# Altium schematic sheet Auto_old.SchDoc
size A
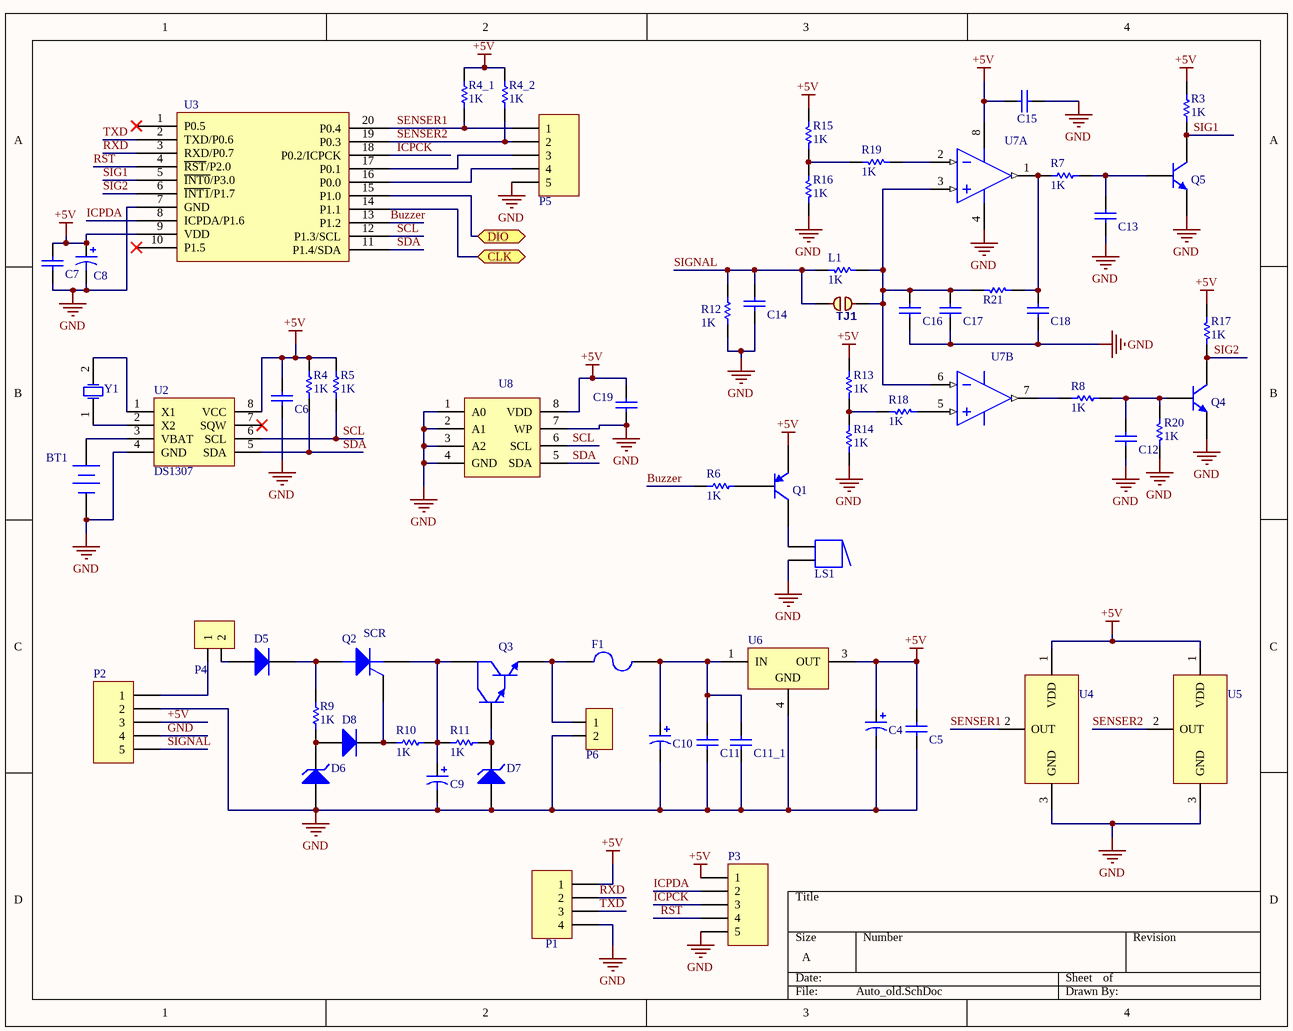
[diagram p0: Auto_old.SchDoc]

## Parts
BT1  Battery  [Battery Holder(CR2032)]  (value not drawn)
C4  Capacitor_Electrolytic  [C1000uF25V]  (value not drawn)
C5  Capacitor_Ceramic  [C0603]  (value not drawn)
C6  Capacitor_Ceramic  [C0603]  (value not drawn)
C7  Capacitor_Ceramic  [C0603]  (value not drawn)
C8  Capacitor_Electrolytic  [C10uF25V]  (value not drawn)
C9  Capacitor_Electrolytic  [C1000uF50V]  (value not drawn)
C10  Capacitor_Electrolytic  [C1000uF50V]  (value not drawn)
C11  Capacitor_Ceramic  [C0805]  (value not drawn)
C11_1  Capacitor_Ceramic  [Capacitor_Ceramic]  (value not drawn)
C12  Capacitor_Ceramic  [C0603]  (value not drawn)
C13  Capacitor_Ceramic  [C0603]  (value not drawn)
C14  Capacitor_Ceramic  [C0603]  (value not drawn)
C15  Capacitor_Ceramic  [C0603]  (value not drawn)
C16  Capacitor_Ceramic  [C0603]  (value not drawn)
C17  Capacitor_Ceramic  [C0603]  (value not drawn)
C18  Capacitor_Ceramic  [C0603]  (value not drawn)
C19  Capacitor_Ceramic  [C0603]  (value not drawn)
D5  Diode  [DO-241]  (value not drawn)
D6  D Zener  [LL-41]  (value not drawn)
D7  D Zener  [LL-41]  (value not drawn)
D8  Diode  [DO-241]  (value not drawn)
F1  Fuse  [1812(PTC Fuse)]  (value not drawn)
L1  value 1K  [Axial 1/4W]  (hidden comment: Res1)
LS1  Buzzer  [Buzzer]  (value not drawn)
P1  Header 4  [HDR1X4]  (value not drawn)
P2  Header 5  [Connector_508_5pin]  (value not drawn)
P3  Header 5  [HDR1X5]  (value not drawn)
P4  Header 2X1  [HDR1X2_2515]  (value not drawn)
P5  Header 5  [HDR1X5_2515]  (value not drawn)
P6  Header 2X1  [HDR1X2_2515]  (value not drawn)
Q1  PNP  [SOT-23]  (value not drawn)
Q2  SCR  [DPAK_SOT423_252]
Q3  NPN1  [DPAK_SOT423_252]  (value not drawn)
Q4  NPN  [SOT-23]  (value not drawn)
Q5  NPN  [SOT-23]  (value not drawn)
R3  value 1K  [R0603]  (hidden comment: Res1)
R4  value 1K  [R0603]  (hidden comment: Res1)
R4_1  value 1K  [R0603]  (hidden comment: Res1)
R4_2  value 1K  [R0603]  (hidden comment: Res1)
R5  value 1K  [R0603]  (hidden comment: Res1)
R6  value 1K  [R0603]  (hidden comment: Res1)
R7  value 1K  [R0603]  (hidden comment: Res1)
R8  value 1K  [R0603]  (hidden comment: Res1)
R9  value 1K  [R1206]  (hidden comment: Res1)
R10  value 1K  [R1206]  (hidden comment: Res1)
R11  value 1K  [R1206]  (hidden comment: Res1)
R12  value 1K  [R0603]  (hidden comment: Res1)
R13  value 1K  [R0603]  (hidden comment: Res1)
R14  value 1K  [R0603]  (hidden comment: Res1)
R15  value 1K  [R0603]  (hidden comment: Res1)
R16  value 1K  [R0603]  (hidden comment: Res1)
R17  value 1K  [R0603]  (hidden comment: Res1)
R18  value 1K  [R0603]  (hidden comment: Res1)
R19  value 1K  [R0603]  (hidden comment: Res1)
R20  value 1K  [R0603]  (hidden comment: Res1)
R21  Res1  [R0603]  (value not drawn)
TJ1  JUMPER-PAD-2-NO_BY_TRACE  [PAD_JUMPER_2_NO]  (value not drawn)
U2  DS1307  [SOIC-8N]
U3  8051  [TSSOP-20]  (value not drawn)
U4  Hall effect Switch  [SOT-23]  (value not drawn)
U5  Hall effect Switch  [SOT-23]  (value not drawn)
U6  LM7805_DPAK  [DPAK_SOT423_252]  (value not drawn)
U7  OP-AMP  [SOIC-8N]  (value not drawn)  (parts A,B of 2)
U8  EEPROM  [SOIC-8N]  (value not drawn)
Y1  XTAL  [Craystal]  (value not drawn)

## Ports
CLK, DIO

## Nets
+5V: C4.1 C5.2 C6.2 C7.2 C8.1 C15.2 C19.1 P1.1 P2.3 P3.1 Q1.2(E) R3.1 R4.2 R4_1.2 R4_2.2 R5.2 R13.1 R15.2 R17.2 U2.8(VCC) U3.9(VDD) U4.1(VDD) U5.1(VDD) U6.3(OUT) U7.8(VCC) U8.8(VDD)
GND: BT1.2(-) C4.2 C5.1 C6.1 C7.1 C8.2 C9.2 C10.2 C11.1 C11_1.1 C12.1 C13.1 C14.1 C15.1 C16.2 C17.2 C18.2 C19.2 D6.1(A) D7.1(A) LS1.2 P1.4 P2.2 P2.4 P3.5 P5.5 P6.2 Q4.2(E) Q5.2(E) R12.2 R14.1 R16.1 R20.2 U2.4(GND) U3.7(GND) U4.3(GND) U5.3(GND) U6.4(GND) U7.4(GND) U8.1(A0) U8.2(A1) U8.3(A2) U8.4(GND) U8.7(WP)
Buzzer: R6.2 U3.13(P1.2)
CLK: U3.14(P1.1) ; port CLK
DIO: U3.15(P1.0) ; port DIO
ICPCK: P3.3 U3.18(P0.2/ICPCK)
ICPDA: P3.2 U3.8(ICPDA/P1.6)
RST: P3.4 U3.4(~{RST}/P2.0)
RXD: P1.2 U3.3(RXD/P0.7)
SCL: R5.1 U2.6(SCL) U3.12(P1.3/SCL) U8.6(SCL)
SDA: R4.1 U2.5(SDA) U3.11(P1.4/SDA) U8.5(SDA)
SENSER1: P5.1 R4_1.1 U3.20(P0.4) U4.2(OUT)
SENSER2: P5.2 R4_2.1 U3.19(P0.3) U5.2(OUT)
SIG1: Q5.3(C) R3.2 U3.5(~{INT0}/P3.0)
SIG2: Q4.3(C) R17.1 U3.6(~{INT1}/P1.7)
SIGNAL: C14.2 L1.1 P2.5 R12.1 TJ1.1
TXD: P1.3 U3.2(TXD/P0.6)
NetBT1_1: BT1.1(+) U2.3(VBAT)
NetC9_1: C9.1 Q2.1(K) Q3.4(C) R10.1 R11.2
NetC10_1: C10.1 C11.2 C11_1.2 F1.2 U6.1(IN)
NetC12_2: C12.2 Q4.1(B) R8.2 R20.1
NetC13_2: C13.2 Q5.1(B) R7.2
NetC16_1: C16.1 C17.1 L1.2 R21.1 TJ1.2 U7.3(IN+) U7.6(IN-)
NetC18_1: C18.1 R7.1 R21.2 U7.1(OUT)
NetD5_1: D5.1(A) P4.2
NetD5_2: D5.2(K) Q2.4(A) R9.2
NetD6_2: D6.2(K) D8.1(A) R9.1
NetD7_2: D7.2(K) Q3.1(B) R11.1
NetD8_2: D8.2(K) Q2.3(G) R10.2
NetF1_1: F1.1 P6.1 Q3.3(E)
NetLS1_1: LS1.1 Q1.3(C)
NetP2_1: P2.1 P4.1
NetP5_3: P5.3 U3.17(P0.1)
NetP5_4: P5.4 U3.16(P0.0)
NetQ1_1: Q1.1(B) R6.1
NetR8_1: R8.1 U7.7(OUT)
NetR13_2: R13.2 R14.2 R18.2
NetR15_1: R15.1 R16.2 R19.2
NetR18_1: R18.1 U7.5(IN+)
NetR19_1: R19.1 U7.2(IN-)
NetU2_1: U2.1(X1) Y1.2(OSC2)
NetU2_2: U2.2(X2) Y1.1(OSC1)

Not connected (* = marked no-connect by the designer): U2 7(SQW)*; U3 1(P0.5)* 10(P1.5)*

## Library data of the parts
BT1 = Battery: Cell Battery; Published: 24-Mar-1999; LatestRevisionDate: 17-Jul-2002; LatestRevisionNote: Re-released for DXP Platform.; PackageReference: BAT-2; Publisher: Altium Limited; PackageDescription: Battery; 2 Leads
D6 D7 = D Zener: Zener Diode; Published: 8-Jun-2000; LatestRevisionDate: 17-Jul-2002; LatestRevisionNote: Re-released for DXP Platform.; PackageReference: DIODE-0.7; Publisher: Altium Limited; PackageDescription: Diode, Thru-Hole; 2 Leads; 0.7 in Pin Spacing
L1 R3 R4 R4_1 R4_2 R5-R20 = Res1: Resistor; Published: 8-Jun-2000; LatestRevisionDate: 17-Jul-2002; LatestRevisionNote: Re-released for DXP Platform.; PackageReference: AXIAL-0.3; Publisher: Altium Limited; PackageDescription: Axial Device, Thru-Hole; 2 Leads; 0.3 in Pin Spacing
LS1 = Buzzer: Magnetic Transducer Buzzer; Published: 24-Mar-1999; LatestRevisionDate: 17-Dec-2003; LatestRevisionNote: Schematic revised, PCB Footprint replaced.; DatasheetVersion: 17-Dec-2003; PackageReference: ABSM-1574; Publisher: Altium Limited; PackageDescription: Magnetic Transducer Buzzer; ComponentLink1Description: Manufacturer Link; ComponentLink1URL: http://www.megastar.com/linecard/buzzmode/index.php
P1 = Header 4: Header, 4-Pin; LatestRevisionDate: 17-Jul-2002; LatestRevisionNote: Re-released for DXP Platform.; Publisher: Altium Limited
P2 P3 P5 = Header 5: Header, 5-Pin; LatestRevisionDate: 17-Jul-2002; LatestRevisionNote: Re-released for DXP Platform.; Publisher: Altium Limited
Q2 = SCR: Silicon Controlled Rectifier; Published: 8-Jun-2000; LatestRevisionDate: 17-Jul-2002; LatestRevisionNote: Re-released for DXP Platform.; PackageReference: TO-220-AB; Publisher: Altium Limited; Code_JEDEC: TO-220-AB
Q3 = NPN1: NPN Darlington Bipolar Transistor; Published: 8-Jun-2000; LatestRevisionDate: 17-Jul-2002; LatestRevisionNote: Re-released for DXP Platform.; DatasheetVersion: 1989; PackageVersion: 1989; PackageReference: TO-92; Publisher: Altium Limited; PackageDescription: TO, Flat Index; 3 In-Line, Axial Leads; Body Dia. 4.6mm; Leads 0.41 x 0.39 mm (max); Code_JEDEC: TO-92
R21 = Res1: Resistor; Value: 1K; Published: 8-Jun-2000; LatestRevisionDate: 17-Jul-2002; LatestRevisionNote: Re-released for DXP Platform.; PackageReference: AXIAL-0.3; Publisher: Altium Limited; PackageDescription: Axial Device, Thru-Hole; 2 Leads; 0.3 in Pin Spacing
U3 = N76E003
U4 U5 = AH1802
U7 = LM158
U8 = 24Cxx
Y1 = XTAL: Crystal Oscillator; Published: 8-Jun-2000; LatestRevisionDate: 17-Jul-2002; LatestRevisionNote: Re-released for DXP Platform.; PackageReference: R38; Publisher: Altium Limited; PackageDescription: Crystal, Thru-Hole; 2 Leads; Body 3.1 x 8.2 mm (Dia.xH)
C5-C7 C11 C11_1 C12-C19 = Capacitor_Ceramic: Value: *